# Altium schematic sheet OUT_Connectors.SchDoc
size A4; SheetNumber: 6; SheetTotal: 13
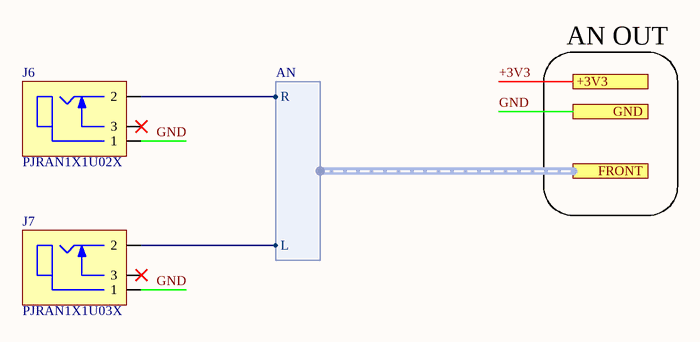
[diagram p0: OUT_Connectors.SchDoc]

## Parts
J6  PJRAN1X1U02X  [RCA1X1-RA - SW]
J7  PJRAN1X1U03X  [RCA1X1-RA - SW]

## Ports
+3V3 (see AudioDSP-v3.0.0c_top[8B], ADC_Block[1A], ADC_Interface[1B], CTRL_Connectors[1A], DAC_Block[1B], DSP_Block[1A], IN_Connectors[3B], MCU_Block[1A], PLL_Block[1A], POW_Block[4B]), FRONT (harness AN, see AudioDSP-v3.0.0c_top[8B]), GND (see AudioDSP-v3.0.0c_top[8B], ADC_Block[1B], ADC_Interface[1B], CTRL_Connectors[1A], DAC_Block[1B], DSP_Block[1A], IN_Connectors[3A], LPF_Block[1B], LPF_Interface[1B], MCU_Block[1B], PLL_Block[1A], POW_Block[1B])

## Harnesses
AN: L, R

## Nets
+3V3: port +3V3
GND: J6.1 J7.1 ; port GND
NetJ6_2: J6.2 ; port FRONT.R
NetJ7_2: J7.2 ; port FRONT.L

Not connected (* = marked no-connect by the designer): J6 3*; J7 3*

## Notes on the sheet
- AN OUT

## Library data of the parts
J6 = PJRAN1X1U02X: CONN RCA JACK MONO 3.2MM R/A WHITE; Digikey_PN: PJRAN1X1U02X-ND
J7 = PJRAN1X1U03X: CONN RCA JACK MONO 3.2MM R/A RED; Digikey_PN: PJRAN1X1U03X-ND